# Altium schematic sheet Proximity.SchDoc: Proximity sensors
size A4; Organization: Use Organization_Name in ProjParam; Address1: EFI & DBR; Address2: STI-IMT-LSRO1; Address3: EPFL; Address4: CH-1015 LAUSANNE; DocumentNumber: 9; Revision: A; SheetNumber: 9; SheetTotal: 2; ApprovedBy: Init ApprovedBy in DocParam; CheckedBy: Init CheckedBy in DocParam; Author: Init Author in DocParam; CompanyName: Init CompanyName in DocParam; DrawnBy: Init DrawBy in DocParam; Engineer: Init Engineer in DocParam; DocumentName: Init DocumentName in DocParam; ProjectName: Init ProjectName in DocParam
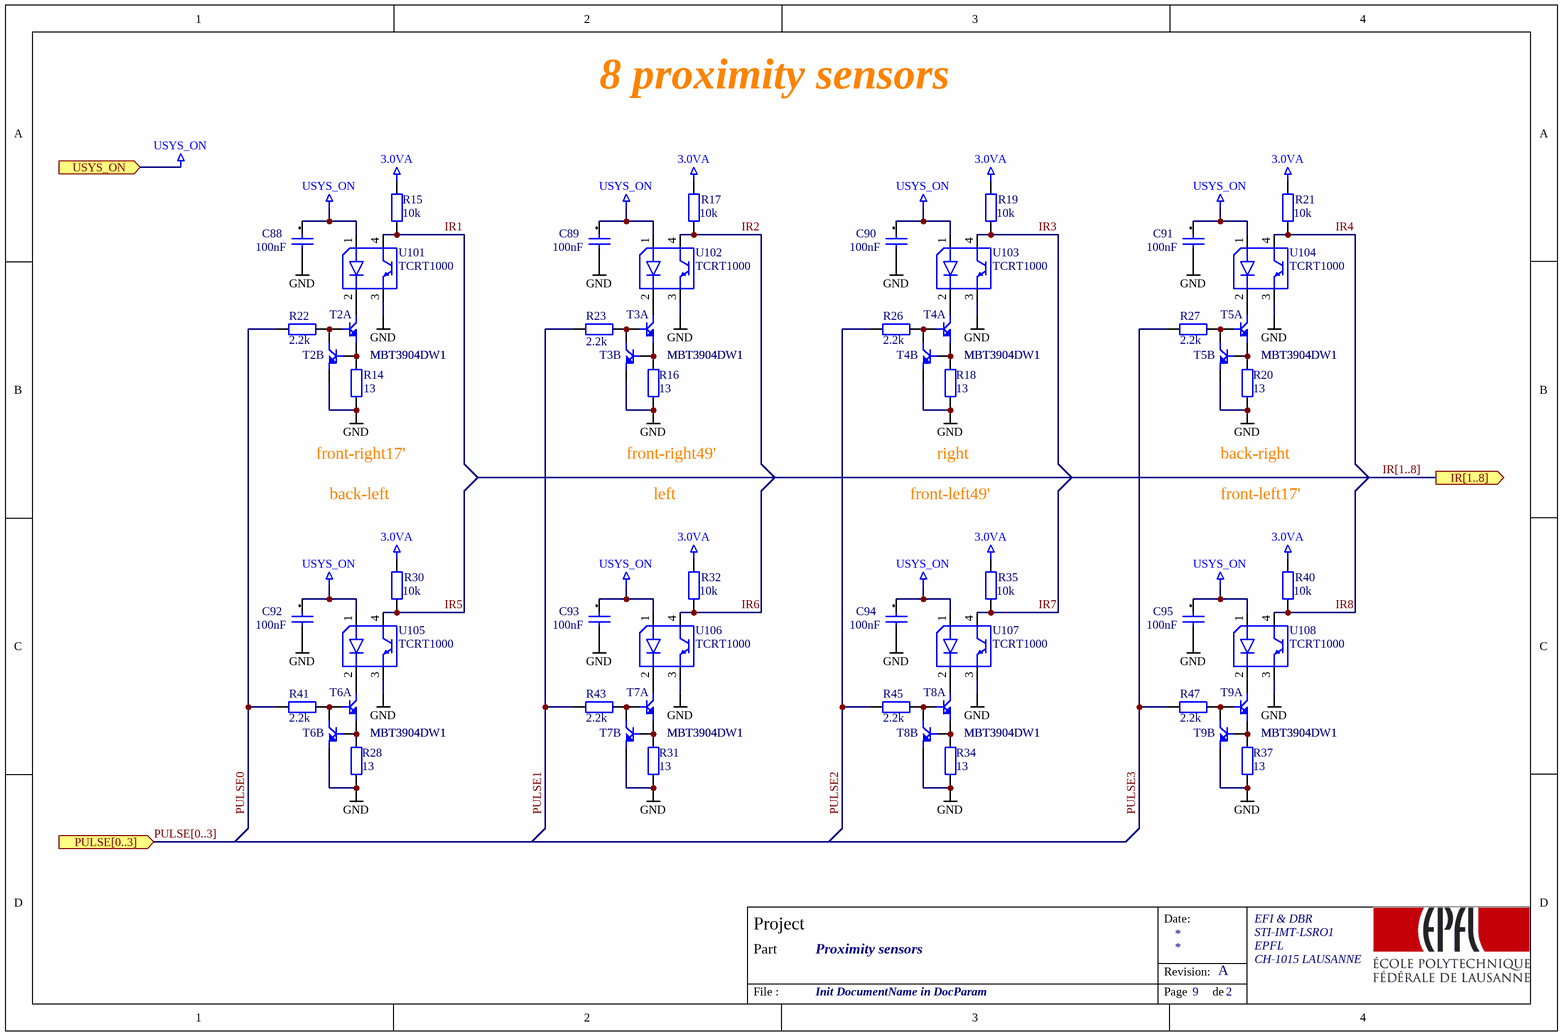
[diagram p0: Proximity.SchDoc]

## Parts
C88  100nF  [ROB_0603]
C89  100nF  [ROB_0603]
C90  100nF  [ROB_0603]
C91  100nF  [ROB_0603]
C92  100nF  [ROB_0603]
C93  100nF  [ROB_0603]
C94  100nF  [ROB_0603]
C95  100nF  [ROB_0603]
R14  13  [ROB_0603]
R15  10k  [ROB_0603]
R16  13  [ROB_0603]
R17  10k  [ROB_0603]
R18  13  [ROB_0603]
R19  10k  [ROB_0603]
R20  13  [ROB_0603]
R21  10k  [ROB_0603]
R22  2.2k  [ROB_0603]
R23  2.2k  [ROB_0603]
R26  2.2k  [ROB_0603]
R27  2.2k  [ROB_0603]
R28  13  [ROB_0603]
R30  10k  [ROB_0603]
R31  13  [ROB_0603]
R32  10k  [ROB_0603]
R34  13  [ROB_0603]
R35  10k  [ROB_0603]
R37  13  [ROB_0603]
R40  10k  [ROB_0603]
R41  2.2k  [ROB_0603]
R43  2.2k  [ROB_0603]
R45  2.2k  [ROB_0603]
R47  2.2k  [ROB_0603]
T2  MBT3904DW1  [SC70-6]  (parts A,B of 2)
T3  MBT3904DW1  [SC70-6]  (parts A,B of 2)
T4  MBT3904DW1  [SC70-6]  (parts A,B of 2)
T5  MBT3904DW1  [SC70-6]  (parts A,B of 2)
T6  MBT3904DW1  [SC70-6]  (parts A,B of 2)
T7  MBT3904DW1  [SC70-6]  (parts A,B of 2)
T8  MBT3904DW1  [SC70-6]  (parts A,B of 2)
T9  MBT3904DW1  [SC70-6]  (parts A,B of 2)
U101  TCRT1000  [TCRT1000]
U102  TCRT1000  [TCRT1000]
U103  TCRT1000  [TCRT1000]
U104  TCRT1000  [TCRT1000]
U105  TCRT1000  [TCRT1000]
U106  TCRT1000  [TCRT1000]
U107  TCRT1000  [TCRT1000]
U108  TCRT1000  [TCRT1000]

## Ports
IR[1..8] (out), PULSE[0..3] (in), USYS_ON (in)

## Nets
3.0VA: R15.1 R17.1 R19.1 R21.1 R30.1 R32.1 R35.1 R40.1
GND: C88.2 C89.2 C90.2 C91.2 C92.2 C93.2 C94.2 C95.2 R14.2 R16.1 R18.1 R20.1 R28.1 R31.1 R34.1 R37.1 T2.4(E2) T3.4(E2) T4.4(E2) T5.4(E2) T6.4(E2) T7.4(E2) T8.4(E2) T9.4(E2) U101.3(E) U102.3(E) U103.3(E) U104.3(E) U105.3(E) U106.3(E) U107.3(E) U108.3(E)
USYS_ON: C88.1 C89.1 C90.1 C91.1 C92.1 C93.1 C94.1 C95.1 U101.1(A) U102.1(A) U103.1(A) U104.1(A) U105.1(A) U106.1(A) U107.1(A) U108.1(A) ; port USYS_ON
IR1: R15.2 U101.4(C)
IR2: R17.2 U102.4(C)
IR3: R19.2 U103.4(C)
IR4: R21.2 U104.4(C)
IR5: R30.2 U105.4(C)
IR6: R32.2 U106.4(C)
IR7: R35.2 U107.4(C)
IR8: R40.2 U108.4(C)
PULSE0: R22.1 R41.1
PULSE1: R23.1 R43.1
PULSE2: R26.1 R45.1
PULSE3: R27.1 R47.1
NetR14_1: R14.1 T2.1(E1) T2.5(B2)
NetR16_2: R16.2 T3.1(E1) T3.5(B2)
NetR18_2: R18.2 T4.1(E1) T4.5(B2)
NetR20_2: R20.2 T5.1(E1) T5.5(B2)
NetR22_2: R22.2 T2.2(B1) T2.3(C2)
NetR23_2: R23.2 T3.2(B1) T3.3(C2)
NetR26_2: R26.2 T4.2(B1) T4.3(C2)
NetR27_2: R27.2 T5.2(B1) T5.3(C2)
NetR28_2: R28.2 T6.1(E1) T6.5(B2)
NetR31_2: R31.2 T7.1(E1) T7.5(B2)
NetR34_2: R34.2 T8.1(E1) T8.5(B2)
NetR37_2: R37.2 T9.1(E1) T9.5(B2)
NetR41_2: R41.2 T6.2(B1) T6.3(C2)
NetR43_2: R43.2 T7.2(B1) T7.3(C2)
NetR45_2: R45.2 T8.2(B1) T8.3(C2)
NetR47_2: R47.2 T9.2(B1) T9.3(C2)
NetT2_6: T2.6(C1) U101.2(K)
NetT3_6: T3.6(C1) U102.2(K)
NetT4_6: T4.6(C1) U103.2(K)
NetT5_6: T5.6(C1) U104.2(K)
NetT6_6: T6.6(C1) U105.2(K)
NetT7_6: T7.6(C1) U106.2(K)
NetT8_6: T8.6(C1) U107.2(K)
NetT9_6: T9.6(C1) U108.2(K)

## Buses and harness runs
bus IR[1..8] = port IR[1..8]
bus PULSE[0..3] = port PULSE[0..3]

## Notes on the sheet
- 8 proximity sensors
- front-right17'
- back-left
- front-right49'
- left
- front-left49'
- right
- front-left17'
- back-right
- Date:
- Project
- Part
- Revision:
- File :
- Page
- de

## Library data of the parts
C88-C95 = 100nF[[/\]]0603[[/\]]1: Capacitor; Manufacturer: Kemet; Manufacturer Nr: C0603C104K5RAC; Preference: 1; Tolerance +: +10; Tolerance -: -10; Dielectric: X7R; Voltage: 50; MaxTemperature: +125; MinTemperature: -55; Quant_1: 10; Quant_2: 100; Quant_3: 1000; Quant_4: 4000; Currentie: CHF; Size: 0603; Footprint Acort: 0603_G; Supplier: Farnell; Supplier Nr: 1288255; ComponentLink2Description: Farnell link; ComponentLink2URL: http://ch.farnell.com/jsp/displayProduct.jsp?sku=1288255; Price_1: 0,046; Price_2: 0,04; Price_3: 0,037; Price_4: 0,036; ROHS: True; DateLastUpdate: 2007-12-03 / 14:22:31; Value: 100nF
R14-R23 R26-R28 R30-R32 R34 R35 R37 R40 R41 R43 R45 R47 = Res2: Resistor; Published: 8-Jun-2000; LatestRevisionDate: 17-Jul-2002; LatestRevisionNote: Re-released for DXP Platform.; PackageReference: AXIAL-0.4; Publisher: Altium Limited
  R14 R16 R18 R20 R28 R31 R34 R37: Value: 13
  R15 R17 R19 R21 R30 R32 R35 R40: Value: 10k
  R22 R23 R26 R27 R41 R43 R45 R47: Value: 2.2k
T2-T9 = MBT3904DW1: Dual NPN 0.2A; PackageDocument: 1995/1996; Published: 8-Jun-2000; LatestRevisionDate: 17-Jul-2002; LatestRevisionNote: Re-released for DXP Platform.; PackageReference: E3; Publisher: Altium Limited
U101 = TCRT1000: Reflective Optical Sensor. bottom but top pins must remain 1.4 mm
U102-U108 = TCRT1000: Reflective Optical Sensor with Transistor Output